# Altium project Hand_PCB_Project.PrjPcb
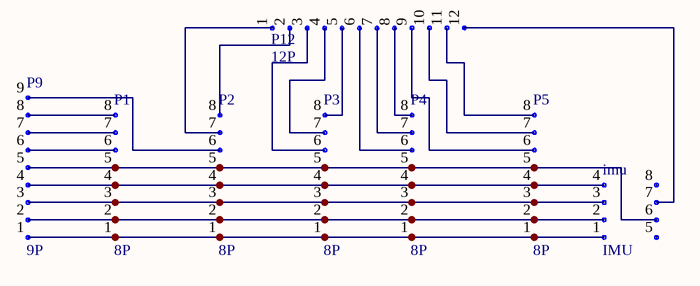
[diagram p0: HandPcb.SchDoc]
2 sheets, 12 parts. Net scope: global (net labels, ports and power ports of the same name join across sheets).
Board files: HandPCB.PcbDoc, WristPcb.PcbDoc
Sheets:
  HandPcb.SchDoc
  Wrist.SchDoc

## Sheet HandPcb.SchDoc
size A4; SheetNumber: 1; SheetTotal: 1

### Parts
imu  IMU  [MPU9250]
P1  8P  [8P]
P2  8P  [8P]
P3  8P  [8P]
P4  8P  [8P]
P5  8P  [8P]
P9  9P  [9p]
P12  12P  [12P]

### Nets
Netimu_1: imu.1 P1.1 P2.1 P3.1 P4.1 P5.1 P9.1
Netimu_2: imu.2 P1.2 P2.2 P3.2 P4.2 P5.2 P9.2
Netimu_3: imu.3 P1.3 P2.3 P3.3 P4.3 P5.3 P9.3
Netimu_4: imu.4 P1.4 P2.4 P3.4 P4.4 P5.4 P9.4
Netimu_6: imu.6 P1.5 P2.5 P3.5 P4.5 P5.5 P9.5
Netimu_7: imu.7 P12.12
NetP1_6: P1.6 P9.6
NetP1_7: P1.7 P9.7
NetP1_8: P1.8 P9.8
NetP2_6: P2.6 P9.9
NetP2_7: P2.7 P12.1
NetP2_8: P2.8 P12.2
NetP3_6: P3.6 P12.3
NetP3_7: P3.7 P12.4
NetP3_8: P3.8 P12.5
NetP4_6: P4.6 P12.6
NetP4_7: P4.7 P12.7
NetP4_8: P4.8 P12.8
NetP5_6: P5.6 P12.9
NetP5_7: P5.7 P12.10
NetP5_8: P5.8 P12.11

Not connected (* = marked no-connect by the designer): imu 5 8

## Sheet Wrist.SchDoc
size A4; SheetNumber: 2; SheetTotal: 2
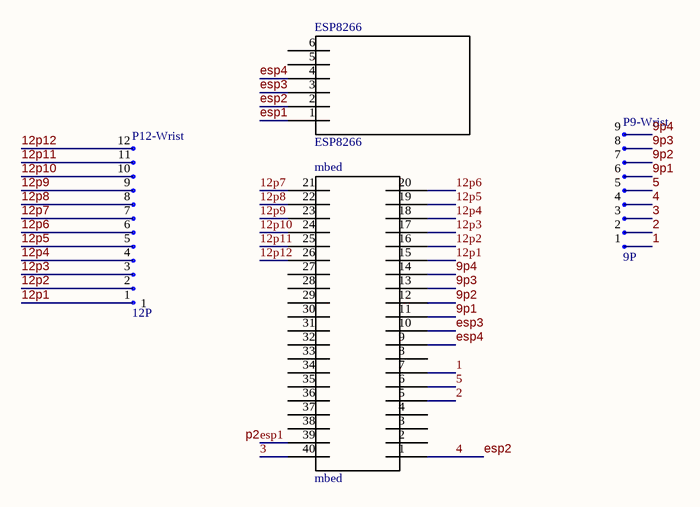
[diagram p1: Wrist.SchDoc]

### Parts
ESP8266  ESP8266  [ESP8266]
mbed  mbed  [Mbed]
P9-Wrist  9P  [9p]
P12-Wrist  12P  [12P]

### Nets
1: mbed.7 P9-Wrist.1
2: mbed.5 P9-Wrist.2
3: mbed.40 P9-Wrist.3
4: ESP8266.2 mbed.1 P9-Wrist.4  [also labelled esp2]
5: mbed.6 P9-Wrist.5
9p1: mbed.11 P9-Wrist.6
9p2: mbed.12 P9-Wrist.7
9p3: mbed.13 P9-Wrist.8
9p4: mbed.14 P9-Wrist.9
12p1: mbed.15 P12-Wrist.1
12p2: mbed.16 P12-Wrist.2
12p3: mbed.17 P12-Wrist.3
12p4: mbed.18 P12-Wrist.4
12p5: mbed.19 P12-Wrist.5
12p6: mbed.20 P12-Wrist.6
12p7: mbed.21 P12-Wrist.7
12p8: mbed.22 P12-Wrist.8
12p9: mbed.23 P12-Wrist.9
12p10: mbed.24 P12-Wrist.10
12p11: mbed.25 P12-Wrist.11
12p12: mbed.26 P12-Wrist.12
esp1: ESP8266.1 mbed.39
esp3: ESP8266.3 mbed.10
esp4: ESP8266.4 mbed.9

Not connected (* = marked no-connect by the designer): ESP8266 5 6; mbed 2 3 4 8 27 28 29 30 31 32 33 34 35 36 37 38

### Notes on the sheet
- Labels drawn without touching a wire or pin: p2